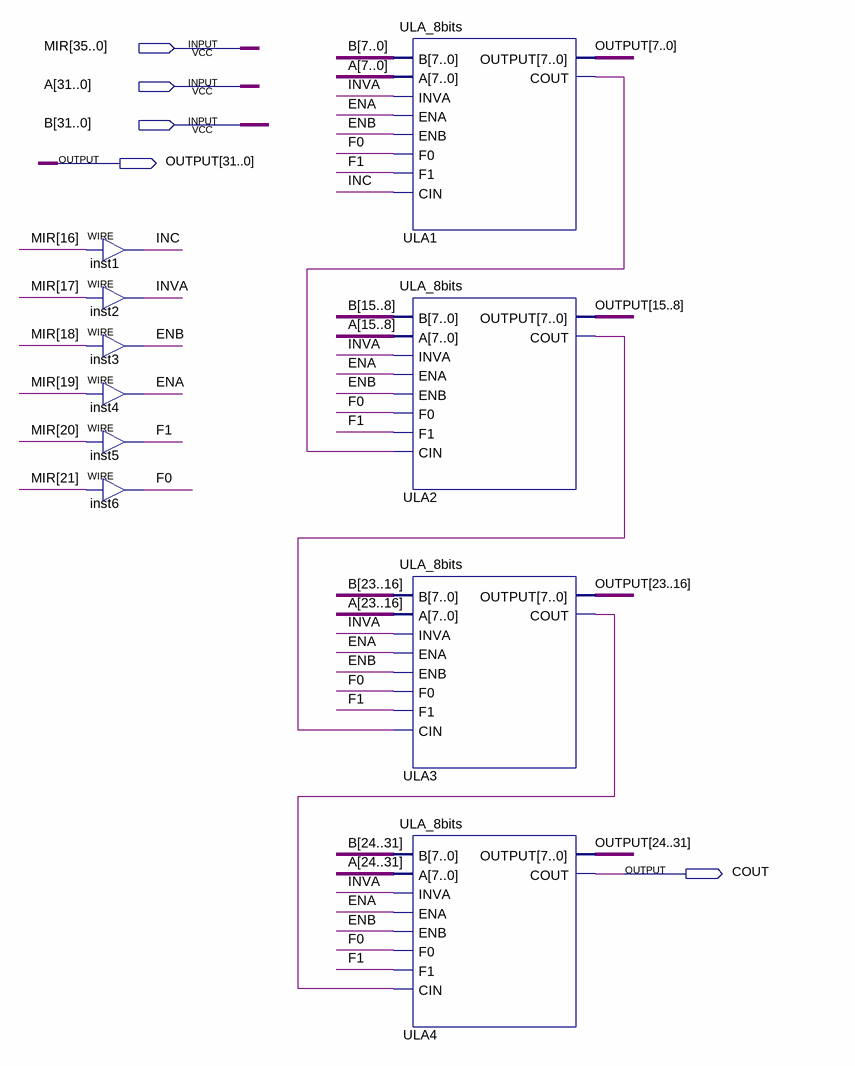
[diagram p0: schematic sheet]
// Quartus schematic ULA_32bits.bdf as structural Verilog: 10 symbols, 5 pins
module ULA_32bits (
  input  [35:0] MIR,
  input  [31:0] A,
  input  [31:0] B,
  output [31:0] OUTPUT,
  output COUT
);

  wire ENA, ENB, F0, F1, INC, INVA, ULA1_cout, ULA2_cout, ULA3_cout;

  assign INC = MIR[16];  // WIRE inst1
  assign INVA = MIR[17];  // WIRE inst2
  assign ENB = MIR[18];  // WIRE inst3
  assign ENA = MIR[19];  // WIRE inst4
  assign F1 = MIR[20];  // WIRE inst5
  assign F0 = MIR[21];  // WIRE inst6
  ULA_8bits ULA1 (
    .B(B[7:0]), .A(A[7:0]), .INVA(INVA), .ENA(ENA), .ENB(ENB), .F0(F0), .F1(F1), .CIN(INC),
    .OUTPUT(OUTPUT[7:0]), .COUT(ULA1_cout));
  ULA_8bits ULA2 (
    .B(B[15:8]), .A(A[15:8]), .INVA(INVA), .ENA(ENA), .ENB(ENB), .F0(F0), .F1(F1), .CIN(ULA1_cout),
    .OUTPUT(OUTPUT[15:8]), .COUT(ULA2_cout));
  ULA_8bits ULA3 (
    .B(B[23:16]), .A(A[23:16]), .INVA(INVA), .ENA(ENA), .ENB(ENB), .F0(F0), .F1(F1), .CIN(ULA2_cout),
    .OUTPUT(OUTPUT[23:16]), .COUT(ULA3_cout));
  ULA_8bits ULA4 (
    .B({B[24], B[25], B[26], B[27], B[28], B[29], B[30], B[31]}),
    .A({A[24], A[25], A[26], A[27], A[28], A[29], A[30], A[31]}), .INVA(INVA), .ENA(ENA), .ENB(ENB), .F0(F0),
    .F1(F1), .CIN(ULA3_cout),
    .OUTPUT({OUTPUT[24], OUTPUT[25], OUTPUT[26], OUTPUT[27], OUTPUT[28], OUTPUT[29], OUTPUT[30], OUTPUT[31]}),
    .COUT(COUT));
endmodule
